# Altium schematic sheet SolderIronOut.SchDoc: PWM
size 381 x 241 mm; DrawnBy: Jansen Robert; Engineer: Jansen Robert; Organization: PXL; SheetNumber: 3; SheetTotal: 4
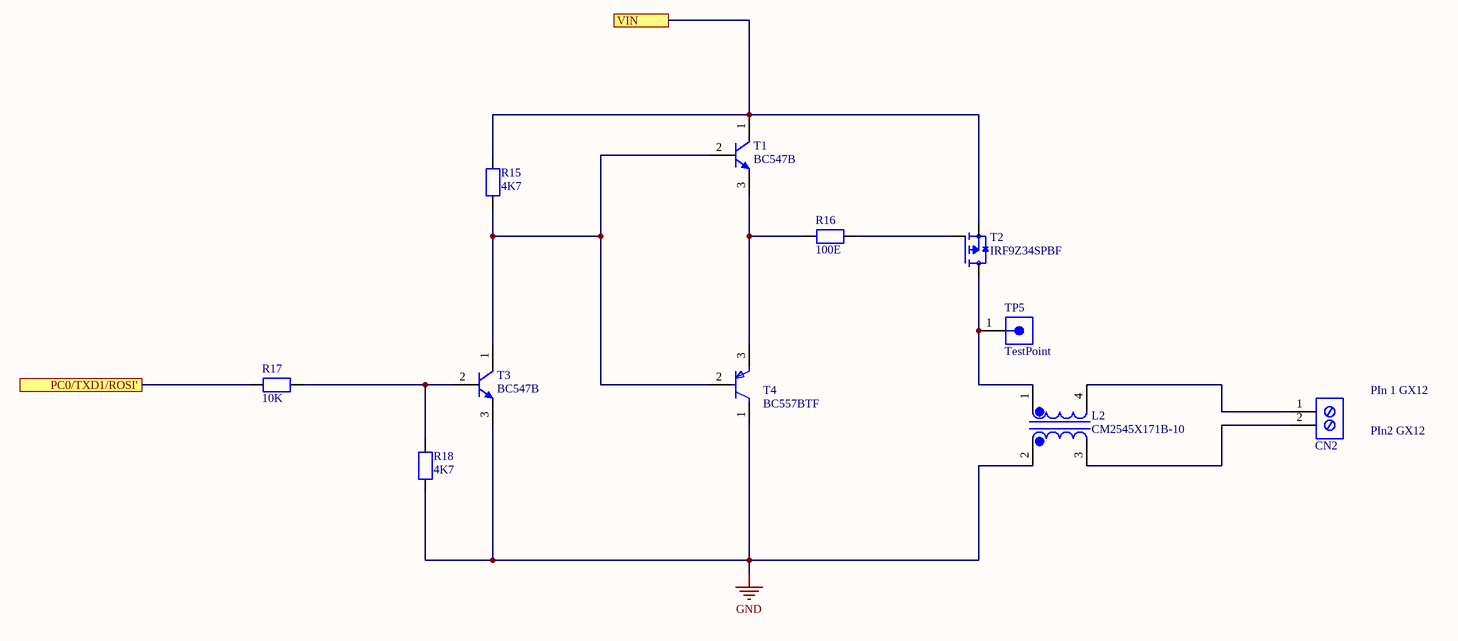
[diagram p0: SolderIronOut.SchDoc]

## Parts
CN2  Printkroonsteen 2 POL  [Printkroonsteen 2pin]  (value not drawn)
L2  CM2545X171B-10  [XFMR_CM2545X171B-10]
R15  4K7  [RESC2012X50N]
R16  100E  [RESC2012X50N]
R17  10K  [RESC2012X50N]
R18  4K7  [RESC2012X50N]
T1  BC547B  [ONSC-TO-92-3-29-11]
T2  IRF9Z34SPBF  [TO254P1521X483-4N]
T3  BC547B  [ONSC-TO-92-3-29-11]
T4  BC557BTF  [ONSC-TO-92-3-29-11]
TP5  TestPoint  [61300111121]

## Ports
PC0/TXD1/ROSI' (see CPU[2B]), VIN (see BatterySource_RelaisOut[3B])

## Nets
GND: L2.2 R18.1 T3.3(E) T4.1(C)
PC0/TXD1/ROSI': R17.2 ; port PC0/TXD1/ROSI'
VIN: R15.2 T1.1(C) T2.3(S) ; port VIN
NetCN2_1: CN2.1 L2.4
NetCN2_2: CN2.2 L2.3
NetL2_1: L2.1 T2.4(D) TP5.1
NetR15_1: R15.1 T1.2(B) T3.1(C) T4.2(B)
NetR16_1: R16.1 T2.1(G)
NetR16_2: R16.2 T1.3(E) T4.3(E)
NetR17_1: R17.1 R18.2 T3.2(B)

## Notes on the sheet
- PIn 1 GX12
- PIn2 GX12

## Library data of the parts
CN2 = printkroonsteen 1 X 2: Printkroonsteen 2 PO L1716020000; Manufacturer_Name: Weidmuller; Datasheet Link: https://catalog.weidmueller.com/catalog/Start.do?ObjectID=1716020000&_ga=2.21797499.1716783809.1613378202-511725545.1613378202; Manufacturer_Part_Number: 1716020000; Mouser Part Number: 470-1716020000; Mouser Price/Stock: https://www.mouser.co.uk/ProductDetail/Weidmuller/1716020000?qs=WJDKaGZ8K%252B7GSEFQgvMjVA%3D%3D
L2 = CM2545X171B-10: 2 Line Common Mode Choke Through Hole 170 Ohms @ 100 MHz 10A DCR 10mOhm; MF: Laird; Value: *; Purchase-URL: https://pricing.snapeda.com/search/part/CM2545X171B-10/?ref=eda; Price: None; Package: Vertical-4 Laird; SnapEDA_Link: https://www.snapeda.com/parts/CM2545X171B-10/Laird/view-part/?ref=snap; Availability: In Stock; Check_prices: https://www.snapeda.com/parts/CM2545X171B-10/Laird/view-part/?ref=eda; MP: CM2545X171B-10
R15-R18 = resistor 0805: Manufacturer: Vishay Dale; Part Number: CRCW08050000Z0EA
T1 T3 = Transistor NPN BC547B THT: Amplifier Transistor, NPN Silicon, 3-Pin TO-92, Bulk Box CMP-1048-01467-1; Manufacturer: On Semiconductor; IC Continuous (A): 0.1; fT Min (MHz): 150; PackageDescription: 3-Pin Transistor Outline, Body 4.825 x 3.685 mm, Pitch 1.27 mm; ComponentLink3URL: http://www.onsemi.cn/pub_link/Collateral/2N6426-D.PDF; PackageVersion: Rev. AM; Packing: Bulk Box; ComponentLink3Description: Package Specification; ComponentLink2URL: http://www.onsemi.com/pub_link/Collateral/BC546-D.PDF; ComponentLink1URL: http://www.onsemi.com/; ComponentLink2Description: Datasheet; Polarity: NPN; Mounting Technology: Through Hole; PackageReference: TO-92-3-29-11_AM_SL; ComponentLink1Description: Manufacturer URL; PartNumber: BC547B; DatasheetVersion: Rev. 7; RoHS: FALSE
T2 = IRF9Z34SPBF: P-Channel 60V 18A _Tc_ 3.7W _Ta_, 88W _Tc_ Surface Mount D2PAK; MF: Vishay; SnapEDA_Link: https://www.snapeda.com/parts/IRF9Z34SPBF/Vishay%20Siliconix/view-part/390212/?ref=snap; Price: None; MP: IRF9Z34SPBF; Value: *; Availability: Unavailable; Package: D2PAK Vishay
T4 = Transistor PNP BC557 THT: BC557BTF Small Signal Bipolar Transistor, 0.1A I(C), 45V V(BR)CEO, 1-Element, PNP, Silicon, TO-92 CMP-00278-84408945-1; Manufacturer Lifecycle Status: ACTIVE; Max Power Dissipation: 500mW; Frequency: 150MHz; hFE Min: 110; Number of Elements: 1; Current Rating: -100mA; Collector Emitter Saturation Voltage: -250mV; Max Collector Current: 100mA; Emitter Base Voltage (VEBO): -5V; Voltage Rating (DC): -45V; Element Configuration: Single; Max Frequency: 10MHz; Collector Base Voltage (VCBO): -50V; Polarity: PNP; Collector Emitter Voltage (VCEO): 45V; Contact Plating: Tin; Min Operating Temperature: -65°C; RoHS: Compliant; Max Operating Temperature: 150°C; Weight: 240mg; Power Dissipation: 500mW; Lifecycle Status: Production; Case/Package: TO-92; Collector Emitter Breakdown Voltage: 45V; Length: 5.2mm; Schedule B: 8541210080, 8541210080|8541210080|8541210080|8541210080|8541210080; Lead Free: Lead Free; REACH SVHC: No SVHC; Mount: Through Hole; NexarPartId: 84408945; Max Breakdown Voltage: 45V; Transition Frequency: 150MHz; Height: 5.33mm; Number of Pins: 3; Gain Bandwidth Product: 150MHz; Width: 4.19mm
TP5 = TestPoint: NexarPartId: 32855518; Operating Supply Voltage: 250V; Connector Type: Male Pin; Contact Resistance: 20mΩ; Number of Contacts: 1; Gender: Male; Current Rating: 3A; Contact Mating Length: 5.9944mm; Number of Pins: 1; Lead Pitch: 2.54mm; Contact Plating: Gold; RoHS: Compliant; Termination: Solder; Mount: Through Hole; Number of Rows: 1; Orientation: Vertical; Contact Material: Copper; Packaging: Bulk; REACH SVHC: Unknown; Number of Positions: 1; Color: Black